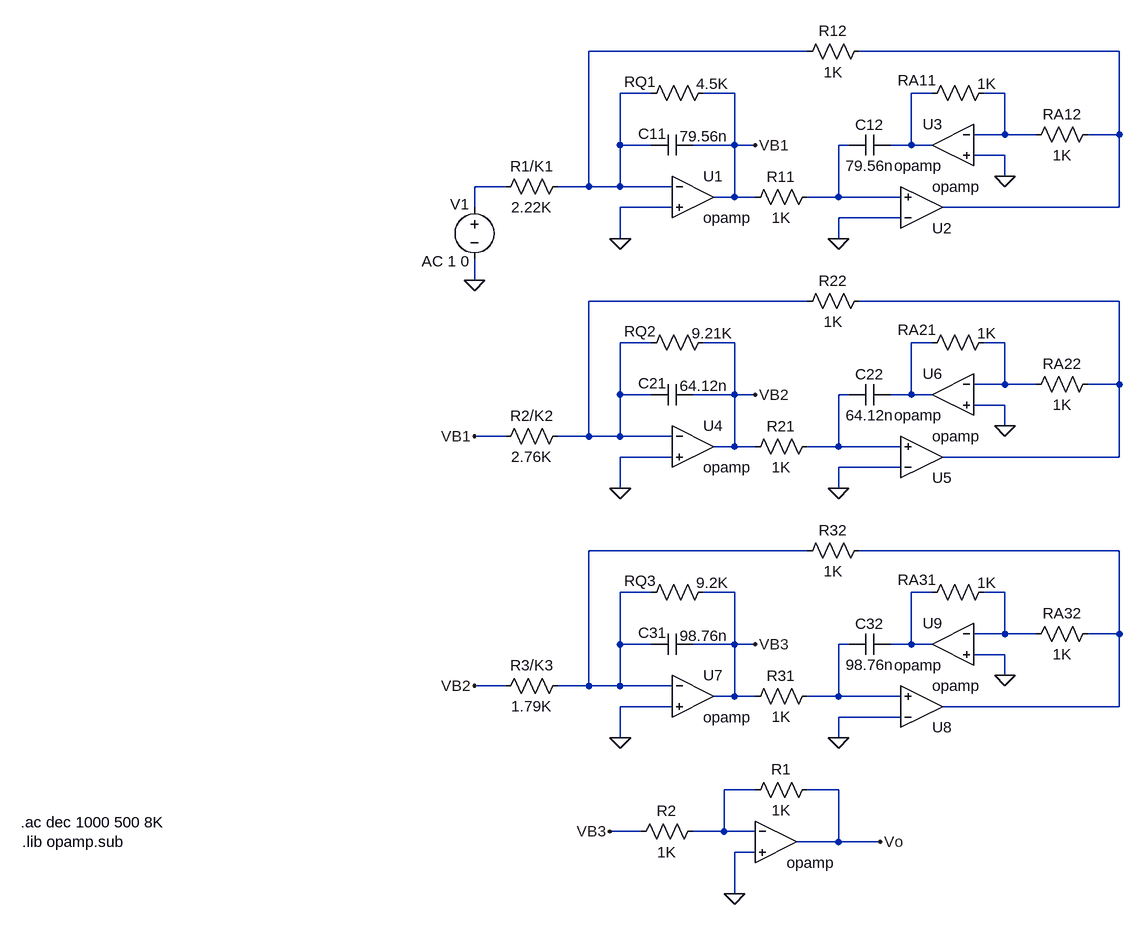
[diagram p0: schematic tp2_ej9.asc]
tp2_ej9.asc, the LTspice schematic file:
Version 4
SHEET 1 880 1204
WIRE 176 -160 -160 -160
WIRE 656 -160 256 -160
WIRE -64 -96 -112 -96
WIRE 64 -96 16 -96
WIRE 368 -96 336 -96
WIRE 480 -96 448 -96
WIRE 480 -32 480 -96
WIRE 480 -32 432 -32
WIRE 528 -32 480 -32
WIRE 656 -32 656 -160
WIRE 656 -32 608 -32
WIRE -112 -16 -112 -96
WIRE -64 -16 -112 -16
WIRE 64 -16 64 -96
WIRE 64 -16 0 -16
WIRE 96 -16 64 -16
WIRE 240 -16 224 -16
WIRE 336 -16 336 -96
WIRE 336 -16 304 -16
WIRE 368 -16 336 -16
WIRE 480 0 432 0
WIRE 480 32 480 0
WIRE -288 48 -336 48
WIRE -160 48 -160 -160
WIRE -160 48 -208 48
WIRE -112 48 -112 -16
WIRE -112 48 -160 48
WIRE -32 48 -112 48
WIRE 64 64 64 -16
WIRE 64 64 32 64
WIRE 96 64 64 64
WIRE 224 64 224 -16
WIRE 224 64 176 64
WIRE 320 64 224 64
WIRE -336 80 -336 48
WIRE -32 80 -112 80
WIRE 656 80 656 -32
WIRE 656 80 384 80
WIRE 320 96 224 96
WIRE -112 128 -112 80
WIRE 224 128 224 96
WIRE -336 192 -336 160
WIRE 176 224 -160 224
WIRE 656 224 256 224
WIRE -64 288 -112 288
WIRE 64 288 16 288
WIRE 368 288 336 288
WIRE 480 288 448 288
WIRE 480 352 480 288
WIRE 480 352 432 352
WIRE 528 352 480 352
WIRE 656 352 656 224
WIRE 656 352 608 352
WIRE -112 368 -112 288
WIRE -64 368 -112 368
WIRE 64 368 64 288
WIRE 64 368 0 368
WIRE 96 368 64 368
WIRE 240 368 224 368
WIRE 336 368 336 288
WIRE 336 368 304 368
WIRE 368 368 336 368
WIRE 480 384 432 384
WIRE 480 416 480 384
WIRE -288 432 -336 432
WIRE -160 432 -160 224
WIRE -160 432 -208 432
WIRE -112 432 -112 368
WIRE -112 432 -160 432
WIRE -32 432 -112 432
WIRE 64 448 64 368
WIRE 64 448 32 448
WIRE 96 448 64 448
WIRE 224 448 224 368
WIRE 224 448 176 448
WIRE 320 448 224 448
WIRE -32 464 -112 464
WIRE 656 464 656 352
WIRE 656 464 384 464
WIRE 320 480 224 480
WIRE -112 512 -112 464
WIRE 224 512 224 480
WIRE 176 608 -160 608
WIRE 656 608 256 608
WIRE -64 672 -112 672
WIRE 64 672 16 672
WIRE 368 672 336 672
WIRE 480 672 448 672
WIRE 480 736 480 672
WIRE 480 736 432 736
WIRE 528 736 480 736
WIRE 656 736 656 608
WIRE 656 736 608 736
WIRE -112 752 -112 672
WIRE -64 752 -112 752
WIRE 64 752 64 672
WIRE 64 752 0 752
WIRE 96 752 64 752
WIRE 240 752 224 752
WIRE 336 752 336 672
WIRE 336 752 304 752
WIRE 368 752 336 752
WIRE 480 768 432 768
WIRE 480 800 480 768
WIRE -288 816 -336 816
WIRE -160 816 -160 608
WIRE -160 816 -208 816
WIRE -112 816 -112 752
WIRE -112 816 -160 816
WIRE -32 816 -112 816
WIRE 64 832 64 752
WIRE 64 832 32 832
WIRE 96 832 64 832
WIRE 224 832 224 752
WIRE 224 832 176 832
WIRE 320 832 224 832
WIRE -32 848 -112 848
WIRE 656 848 656 736
WIRE 656 848 384 848
WIRE 320 864 224 864
WIRE -112 896 -112 848
WIRE 224 896 224 864
WIRE 96 976 48 976
WIRE 224 976 176 976
WIRE -80 1040 -128 1040
WIRE 48 1040 48 976
WIRE 48 1040 0 1040
WIRE 96 1040 48 1040
WIRE 224 1056 224 976
WIRE 224 1056 160 1056
WIRE 288 1056 224 1056
WIRE 96 1072 64 1072
WIRE 64 1136 64 1072
FLAG -112 128 0
FLAG 224 128 0
FLAG -336 192 0
FLAG 480 32 0
FLAG 96 -16 VB1
FLAG -112 512 0
FLAG 224 512 0
FLAG 480 416 0
FLAG 96 368 VB2
FLAG -336 432 VB1
FLAG -112 896 0
FLAG 224 896 0
FLAG 480 800 0
FLAG 96 752 VB3
FLAG -336 816 VB2
FLAG 288 1056 Vo
FLAG -128 1040 VB3
FLAG 64 1136 0
SYMBOL Opamps\\opamp 0 0 R0
SYMATTR InstName U1
SYMBOL Opamps\\opamp 352 144 M180
SYMATTR InstName U2
SYMBOL Opamps\\opamp 400 -80 M0
SYMATTR InstName U3
SYMBOL res 192 48 R90
WINDOW 0 0 56 VBottom 2
WINDOW 3 32 56 VTop 2
SYMATTR InstName R11
SYMATTR Value 1K
SYMBOL cap 0 -32 R90
WINDOW 0 14 62 VBottom 2
WINDOW 3 -13 -17 VTop 2
SYMATTR InstName C11
SYMATTR Value 79.56n
SYMBOL res 32 -112 R90
WINDOW 0 14 113 VBottom 2
WINDOW 3 -14 2 VTop 2
SYMATTR InstName RQ1
SYMATTR Value 4.5K
SYMBOL res -192 32 R90
WINDOW 0 0 56 VBottom 2
WINDOW 3 32 56 VTop 2
SYMATTR InstName R1/K1
SYMATTR Value 2.22K
SYMBOL voltage -336 64 R0
WINDOW 0 -37 11 Left 2
WINDOW 3 -34 97 Left 2
WINDOW 123 -81 99 Left 2
WINDOW 39 0 0 Left 0
SYMATTR InstName V1
SYMATTR Value ""
SYMATTR Value2 AC 1 0
SYMBOL res 272 -176 R90
WINDOW 0 0 56 VBottom 2
WINDOW 3 32 56 VTop 2
SYMATTR InstName R12
SYMATTR Value 1K
SYMBOL cap 304 -32 R90
WINDOW 0 0 32 VBottom 2
WINDOW 3 32 32 VTop 2
SYMATTR InstName C12
SYMATTR Value 79.56n
SYMBOL res 464 -112 R90
WINDOW 0 12 119 VBottom 2
WINDOW 3 -14 12 VTop 2
SYMATTR InstName RA11
SYMATTR Value 1K
SYMBOL res 624 -48 R90
WINDOW 0 0 56 VBottom 2
WINDOW 3 32 56 VTop 2
SYMATTR InstName RA12
SYMATTR Value 1K
SYMBOL Opamps\\opamp 0 384 R0
SYMATTR InstName U4
SYMBOL Opamps\\opamp 352 528 M180
SYMATTR InstName U5
SYMBOL Opamps\\opamp 400 304 M0
SYMATTR InstName U6
SYMBOL res 192 432 R90
WINDOW 0 0 56 VBottom 2
WINDOW 3 32 56 VTop 2
SYMATTR InstName R21
SYMATTR Value 1K
SYMBOL cap 0 352 R90
WINDOW 0 14 62 VBottom 2
WINDOW 3 -13 -17 VTop 2
SYMATTR InstName C21
SYMATTR Value 64.12n
SYMBOL res 32 272 R90
WINDOW 0 14 113 VBottom 2
WINDOW 3 -14 2 VTop 2
SYMATTR InstName RQ2
SYMATTR Value 9.21K
SYMBOL res -192 416 R90
WINDOW 0 0 56 VBottom 2
WINDOW 3 32 56 VTop 2
SYMATTR InstName R2/K2
SYMATTR Value 2.76K
SYMBOL res 272 208 R90
WINDOW 0 0 56 VBottom 2
WINDOW 3 32 56 VTop 2
SYMATTR InstName R22
SYMATTR Value 1K
SYMBOL cap 304 352 R90
WINDOW 0 0 32 VBottom 2
WINDOW 3 32 32 VTop 2
SYMATTR InstName C22
SYMATTR Value 64.12n
SYMBOL res 464 272 R90
WINDOW 0 12 119 VBottom 2
WINDOW 3 -14 12 VTop 2
SYMATTR InstName RA21
SYMATTR Value 1K
SYMBOL res 624 336 R90
WINDOW 0 0 56 VBottom 2
WINDOW 3 32 56 VTop 2
SYMATTR InstName RA22
SYMATTR Value 1K
SYMBOL Opamps\\opamp 0 768 R0
SYMATTR InstName U7
SYMBOL Opamps\\opamp 352 912 M180
SYMATTR InstName U8
SYMBOL Opamps\\opamp 400 688 M0
SYMATTR InstName U9
SYMBOL res 192 816 R90
WINDOW 0 0 56 VBottom 2
WINDOW 3 32 56 VTop 2
SYMATTR InstName R31
SYMATTR Value 1K
SYMBOL cap 0 736 R90
WINDOW 0 14 62 VBottom 2
WINDOW 3 -13 -17 VTop 2
SYMATTR InstName C31
SYMATTR Value 98.76n
SYMBOL res 32 656 R90
WINDOW 0 14 113 VBottom 2
WINDOW 3 -14 2 VTop 2
SYMATTR InstName RQ3
SYMATTR Value 9.2K
SYMBOL res -192 800 R90
WINDOW 0 0 56 VBottom 2
WINDOW 3 32 56 VTop 2
SYMATTR InstName R3/K3
SYMATTR Value 1.79K
SYMBOL res 272 592 R90
WINDOW 0 0 56 VBottom 2
WINDOW 3 32 56 VTop 2
SYMATTR InstName R32
SYMATTR Value 1K
SYMBOL cap 304 736 R90
WINDOW 0 0 32 VBottom 2
WINDOW 3 32 32 VTop 2
SYMATTR InstName C32
SYMATTR Value 98.76n
SYMBOL res 464 656 R90
WINDOW 0 12 119 VBottom 2
WINDOW 3 -14 12 VTop 2
SYMATTR InstName RA31
SYMATTR Value 1K
SYMBOL res 624 720 R90
WINDOW 0 0 56 VBottom 2
WINDOW 3 32 56 VTop 2
SYMATTR InstName RA32
SYMATTR Value 1K
SYMBOL Opamps\\opamp 128 992 R0
WINDOW 0 0 32 Invisible 2
SYMATTR InstName U10
SYMBOL res 192 960 R90
WINDOW 0 0 56 VBottom 2
WINDOW 3 32 56 VTop 2
SYMATTR InstName R1
SYMATTR Value 1K
SYMBOL res 16 1024 R90
WINDOW 0 0 56 VBottom 2
WINDOW 3 32 56 VTop 2
SYMATTR InstName R2
SYMATTR Value 1K
TEXT -1032 1056 Left 2 !.lib opamp.sub
TEXT -1034 1026 Left 2 !.ac dec 1000 500 8K

The netlist it stands for:
* tp2_ej9.asc
XU1 N001 0 VB1 opamp Aol=100K GBW=10Meg  ; pins invin noninvin out
XU2 0 N005 N002 opamp Aol=100K GBW=10Meg  ; pins invin noninvin out
XU3 N004 0 N003 opamp Aol=100K GBW=10Meg  ; pins invin noninvin out
R11 N005 VB1 1K
C11 VB1 N001 79.56n
RQ1 VB1 N001 4.5K
R1/K1 N001 N006 2.22K
V1 N006 0 AC 1 0
R12 N002 N001 1K
C12 N003 N005 79.56n
RA11 N004 N003 1K
RA12 N002 N004 1K
XU4 N007 0 VB2 opamp Aol=100K GBW=10Meg  ; pins invin noninvin out
XU5 0 N011 N008 opamp Aol=100K GBW=10Meg  ; pins invin noninvin out
XU6 N010 0 N009 opamp Aol=100K GBW=10Meg  ; pins invin noninvin out
R21 N011 VB2 1K
C21 VB2 N007 64.12n
RQ2 VB2 N007 9.21K
R2/K2 N007 VB1 2.76K
R22 N008 N007 1K
C22 N009 N011 64.12n
RA21 N010 N009 1K
RA22 N008 N010 1K
XU7 N012 0 VB3 opamp Aol=100K GBW=10Meg  ; pins invin noninvin out
XU8 0 N016 N013 opamp Aol=100K GBW=10Meg  ; pins invin noninvin out
XU9 N015 0 N014 opamp Aol=100K GBW=10Meg  ; pins invin noninvin out
R31 N016 VB3 1K
C31 VB3 N012 98.76n
RQ3 VB3 N012 9.2K
R3/K3 N012 VB2 1.79K
R32 N013 N012 1K
C32 N014 N016 98.76n
RA31 N015 N014 1K
RA32 N013 N015 1K
XU10 N017 0 Vo opamp Aol=100K GBW=10Meg  ; pins invin noninvin out
R1 Vo N017 1K
R2 N017 VB3 1K
.lib opamp.sub
.ac dec 1000 500 8K
.backanno
.end

* Results of the author's LTspice run, read from the files saved beside the schematic
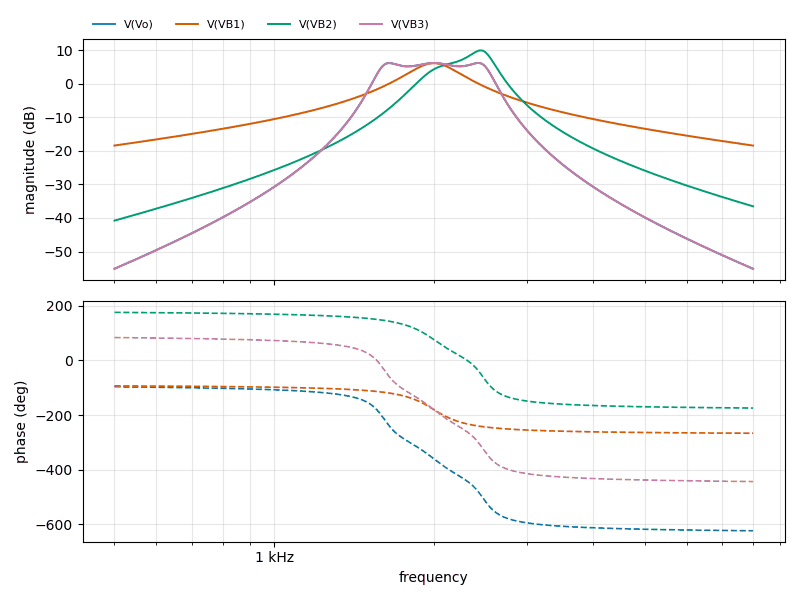
[diagram p1: AC Analysis of tp2_ej9.asc, plotted from the saved traces]
* AC Analysis, 1 run:
*   V(Vo): -55.15 dB at 500 Hz, -55.16 dB at 8 kHz, peak 6.19 dB at 2.426 kHz, 3 dB below the peak at 1.567 kHz and 2.552 kHz
*   V(VB1): -18.42 dB at 500 Hz, -18.42 dB at 8 kHz, peak 6.14 dB at 2 kHz, 3 dB below the peak at 1.79 kHz and 2.234 kHz
*   V(VB2): -40.80 dB at 500 Hz, -36.54 dB at 8 kHz, peak 9.95 dB at 2.455 kHz, 3 dB below the peak at 2.243 kHz and 2.575 kHz
*   V(VB3): -55.15 dB at 500 Hz, -55.16 dB at 8 kHz, peak 6.19 dB at 2.426 kHz, 3 dB below the peak at 1.567 kHz and 2.552 kHz